# Altium schematic sheet main.SchDoc
size A4; SheetNumber: 1; SheetTotal: 4
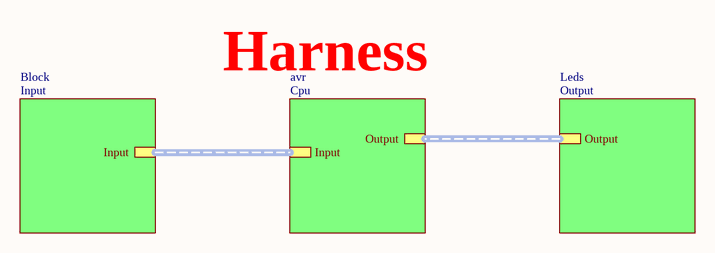
[diagram p0: main.SchDoc]

## Sub-sheets
avr = Cpu: Input, Output
Block = Input: Input
Leds = Output: Output

## Buses and harness runs
harness sheet avr/Input = sheet Block/Input
harness sheet avr/Output = sheet Leds/Output

## Notes on the sheet
- Harness